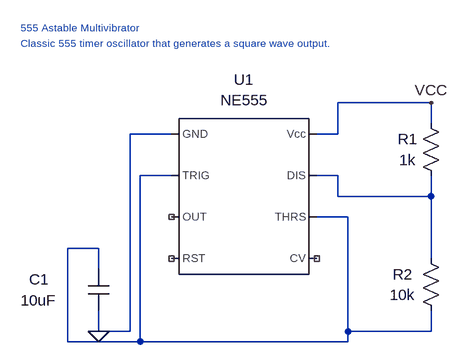
[diagram p0: schematic 555_astable_multivibrator.asc]
555_astable_multivibrator.asc, the LTspice schematic file:
Version 4
SHEET 1 752 576
SYMBOL cap 208 448 R0
WINDOW 0 -76 16 Center 2
WINDOW 3 -76 48 Center 2
SYMATTR InstName C1
SYMATTR Value 10uF
SYMBOL res 752 320 R180
WINDOW 0 52 72 Center 2
WINDOW 3 52 40 Center 2
SYMATTR InstName R1
SYMATTR Value 1k
SYMBOL res 720 416 R0
WINDOW 0 -28 40 Center 2
WINDOW 3 -28 72 Center 2
SYMATTR InstName R2
SYMATTR Value 10k
SYMBOL Misc\NE555 448 336 R0
WINDOW 0 0 -180 Center 2
WINDOW 3 0 -148 Center 2
SYMATTR InstName U1
SYMATTR Value NE555
WIRE 176 416 176 560
WIRE 176 416 224 416
WIRE 176 560 288 560
WIRE 224 416 224 448
WIRE 224 512 224 544
WIRE 224 544 272 544
WIRE 272 240 272 544
WIRE 272 240 336 240
WIRE 288 304 288 560
WIRE 288 304 336 304
WIRE 288 560 608 560
WIRE 560 240 592 240
WIRE 560 304 592 304
WIRE 560 368 608 368
WIRE 592 192 592 240
WIRE 592 192 736 192
WIRE 592 304 592 336
WIRE 592 336 736 336
WIRE 608 368 608 544
WIRE 608 544 608 560
WIRE 608 544 736 544
WIRE 736 192 736 224
WIRE 736 304 736 336
WIRE 736 336 736 432
WIRE 736 512 736 544
FLAG 224 544 0
FLAG 736 192 VCC
TEXT 104 76 Left 1 ;555 Astable Multivibrator
TEXT 104 100 Left 1 ;Classic 555 timer oscillator that generates a square wave output.

The netlist it stands for:
* 555_astable_multivibrator.asc
C1 N001 0 10uF
R1 N002 VCC 1k
R2 N002 N001 10k
XU1 0 N001 NC_01 NC_02 NC_03 N001 N002 VCC NE555  ; pins GND TRIG OUT RST CV THRS DIS Vcc
* 555 Astable Multivibrator
* Classic 555 timer oscillator that generates a square wave output.
.lib NE555.sub
.backanno
.end